# EAGLE design reciever (EAGLE 9.6.2)
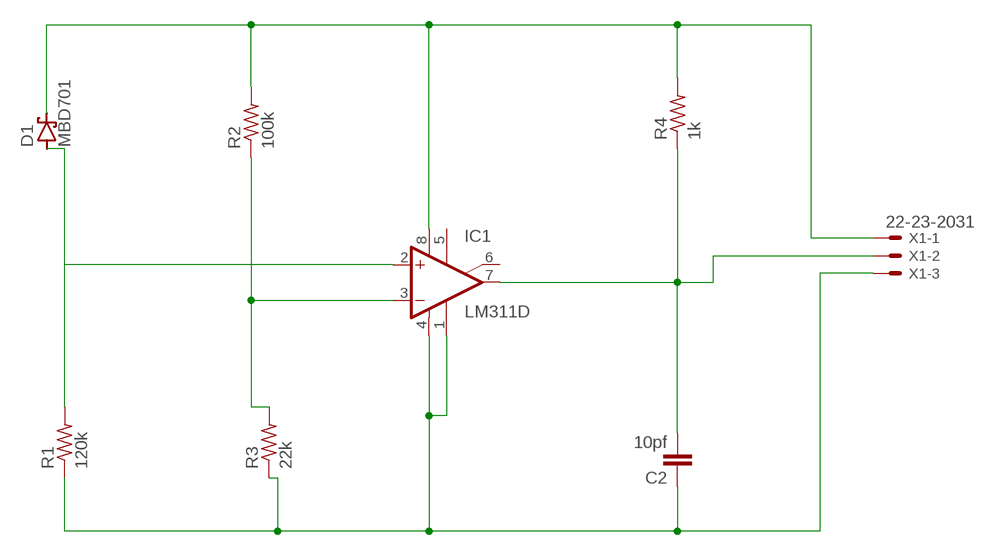
[diagram p0: schematic, sheet 1]

## Parts
C2  10pf  C2.5/2  [C2.5-2]
D1  MBD701  [TO92H]
IC1  LM311D  [SO08]
R1  120k  R-US_0207/10  [0207/10]
R2  100k  R-US_0207/10  [0207/10]
R3  22k  R-US_0207/10  [0207/10]
R4  1k  R-US_0207/10  [0207/10]
X1  22-23-2031  [22-23-2031]

## Nets
N$1: D1.2(C) IC1.8(V+) R2.2 R4.2 X1.1
N$2: C2.1 IC1.1(GND) IC1.4(V-) R1.1 R3.1 X1.3
N$3: D1.1(A) IC1.2(+IN) R1.2
N$4: IC1.3(-IN) R2.1 R3.2
N$5: C2.2 IC1.7(OUT) R4.1 X1.2
Unconnected: IC1.5(ON) IC1.6(ON/STR)

## Library data of the parts
C2 = capacitor-wima:C: CAPACITOR naming: grid - package width
D1 = diode:MBD701: UHF DIODE
IC1 = linear:LM311: COMPARATOR
R1-R4 = rcl:R-US_: RESISTOR, American symbol; SPICEPREFIX: R
X1 = con-molex:22-23-2031: .100" (2.54mm) Center Header - 3 Pin; MF: MOLEX; MPN: 22-23-2031; OC_FARNELL: 1462950; OC_NEWARK: 30C0862

## Board
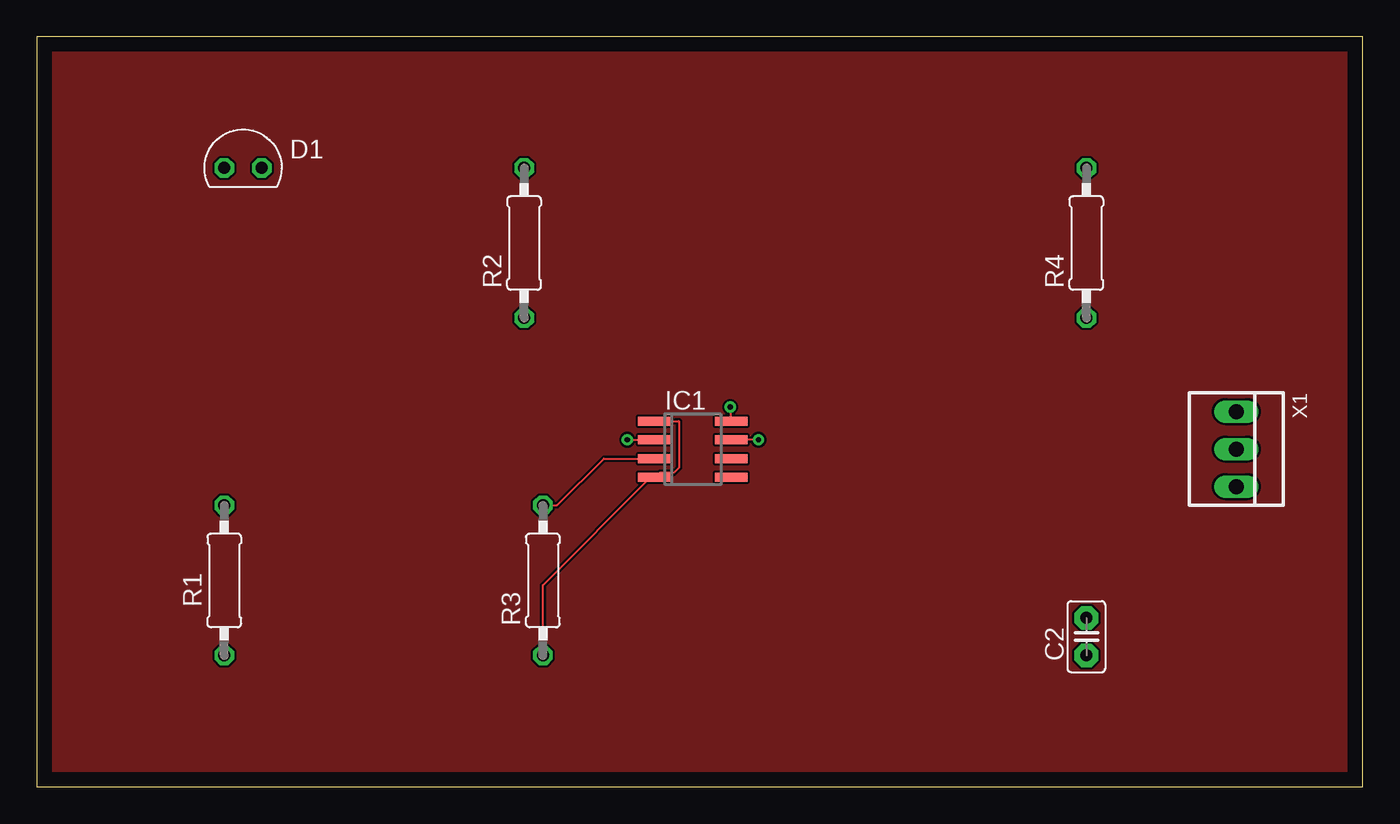
[diagram p1: board, top side]
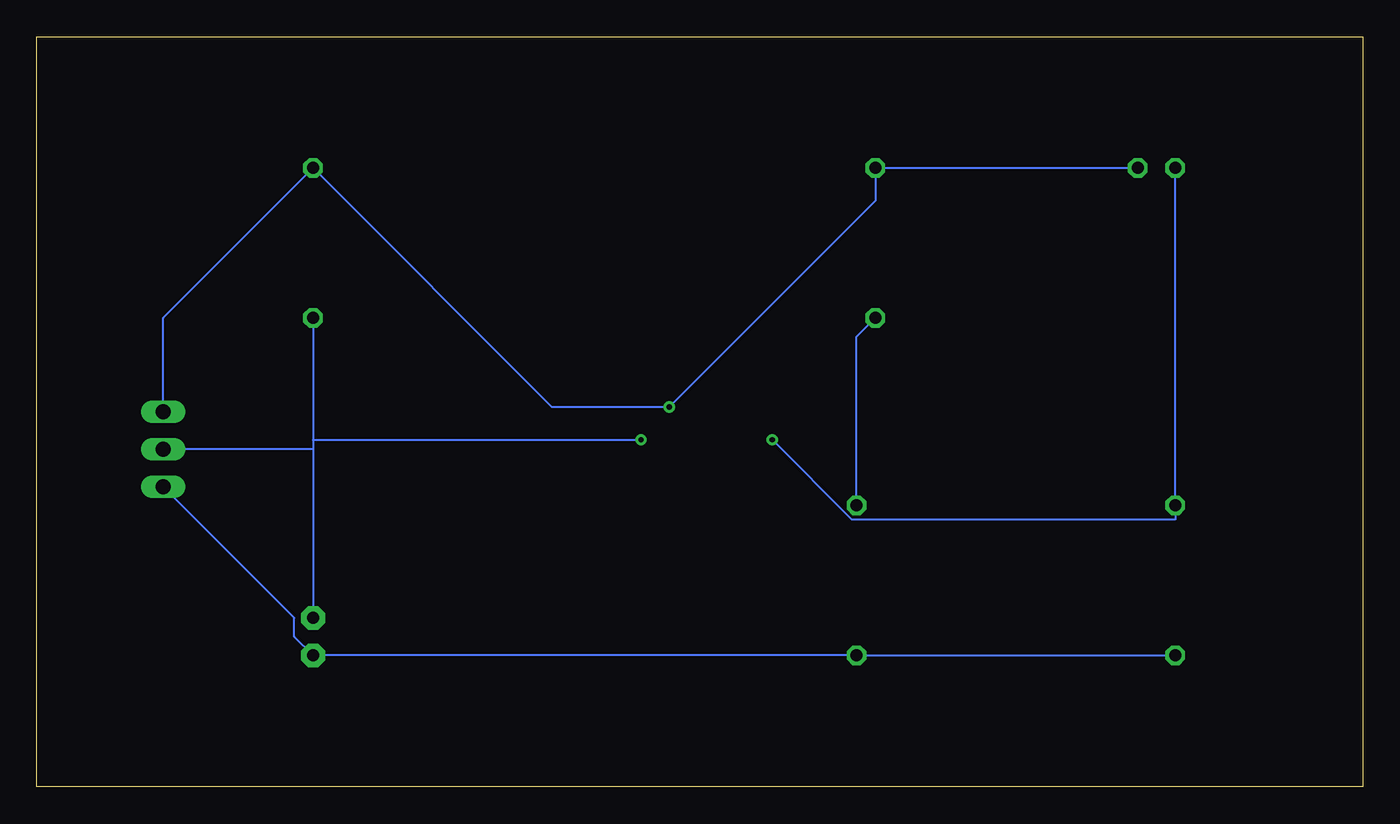
[diagram p2: board, bottom side, seen from below]

Size 89.84 x 50.79 mm. Coordinates in mm from the lower left corner, seen from the top.
Outline: 0,0 89.84,0 89.84,50.79 0,50.79 0,0
Copper layers (1*16): Top 0.035mm / dielectric 1.5mm / Bottom 0.035mm
Design rules "default": minimum track width 6mil, minimum drill 0.35mm, track to track 6mil, track to pad 6mil, pad to pad 6mil, via to via 6mil, smd to smd 6mil, copper to edge 40mil, drill to drill 6mil, minimum pad ring 10mil, minimum via ring 8mil, stop-mask expansion 4mil, vias tented up to drill 0mil, thermal gap 10mil

### Footprints (pad centres in the part's own frame; a part is rotated, then mirrored left to right if it is on the bottom)
C2.5-2 = drill 0.813 pad 1.6 octagon: 1 -1.27,0; 2 1.27,0
TO92H = drill 0.813 octagon: 1 -1.27,0; 2 1.27,0
SO08 = smd 0.6 x 2.2: 1 -1.905,-2.6; 2 -0.635,-2.6; 3 0.635,-2.6; 4 1.905,-2.6; 5 1.905,2.6; 6 0.635,2.6; 7 -0.635,2.6; 8 -1.905,2.6
0207/10 = drill 0.813 octagon: 1 -5.08,0; 2 5.08,0
22-23-2031 = drill 1 long: 1 -2.54,0; 2 0,0; 3 2.54,0

### Placement (x,y rotation side)
C2  71.12,10.16 90 top
D1  13.97,41.91 0 top
IC1  44.45,22.86 270 top
R1  12.7,13.97 90 top
R2  33.02,36.83 90 top
R3  34.29,13.97 90 top
R4  71.12,36.83 90 top
X1  81.28,22.86 270 top

### Tracks (layer width: path | path; a pad name or v marks a point on that pad's centre or on a via)
N$1  (via drill 0.35)
  Top 0.152: v46.99,25.72 46.99,24.77 IC1.8
  Bottom 0.152: X1.1 81.28,31.75 R4.2 54.93,25.72 v46.99,25.72 33.02,39.69 R2.2 D1.2
N$2
  Top 0.152: IC1.1 43.5,24.77 43.5,21.59 43.18,21.27 42.23,21.27 41.91,20.95 IC1.4 41.59,20.95 34.29,13.65 R3.1
  Bottom 0.152: X1.3 72.39,11.43 72.39,10.16 C2.1 R3.1 R1.1
N$3  (via drill 0.35)
  Top 0.152: v40.01,23.49 IC1.2
  Bottom 0.152: v40.01,23.49 34.61,18.1 12.7,18.1 R1.2 D1.1
N$4
  Top 0.152: IC1.3 38.42,22.23 35.24,19.05 R3.2
  Bottom 0.152: R2.1 34.29,30.48 R3.2
N$5  (via drill 0.35)
  Top 0.152: v48.9,23.49 IC1.7
  Bottom 0.152: 71.12,23.49 v48.9,23.49 | R4.1 71.12,23.49 | 71.12,22.86 X1.2 | 71.12,23.49 71.12,22.86 | 71.12,22.86 C2.2
N$6
  pour Top: 0,0 0,50.8 90.17,50.8 90.17,0